# EAGLE design lcmeter (EAGLE 6.4)
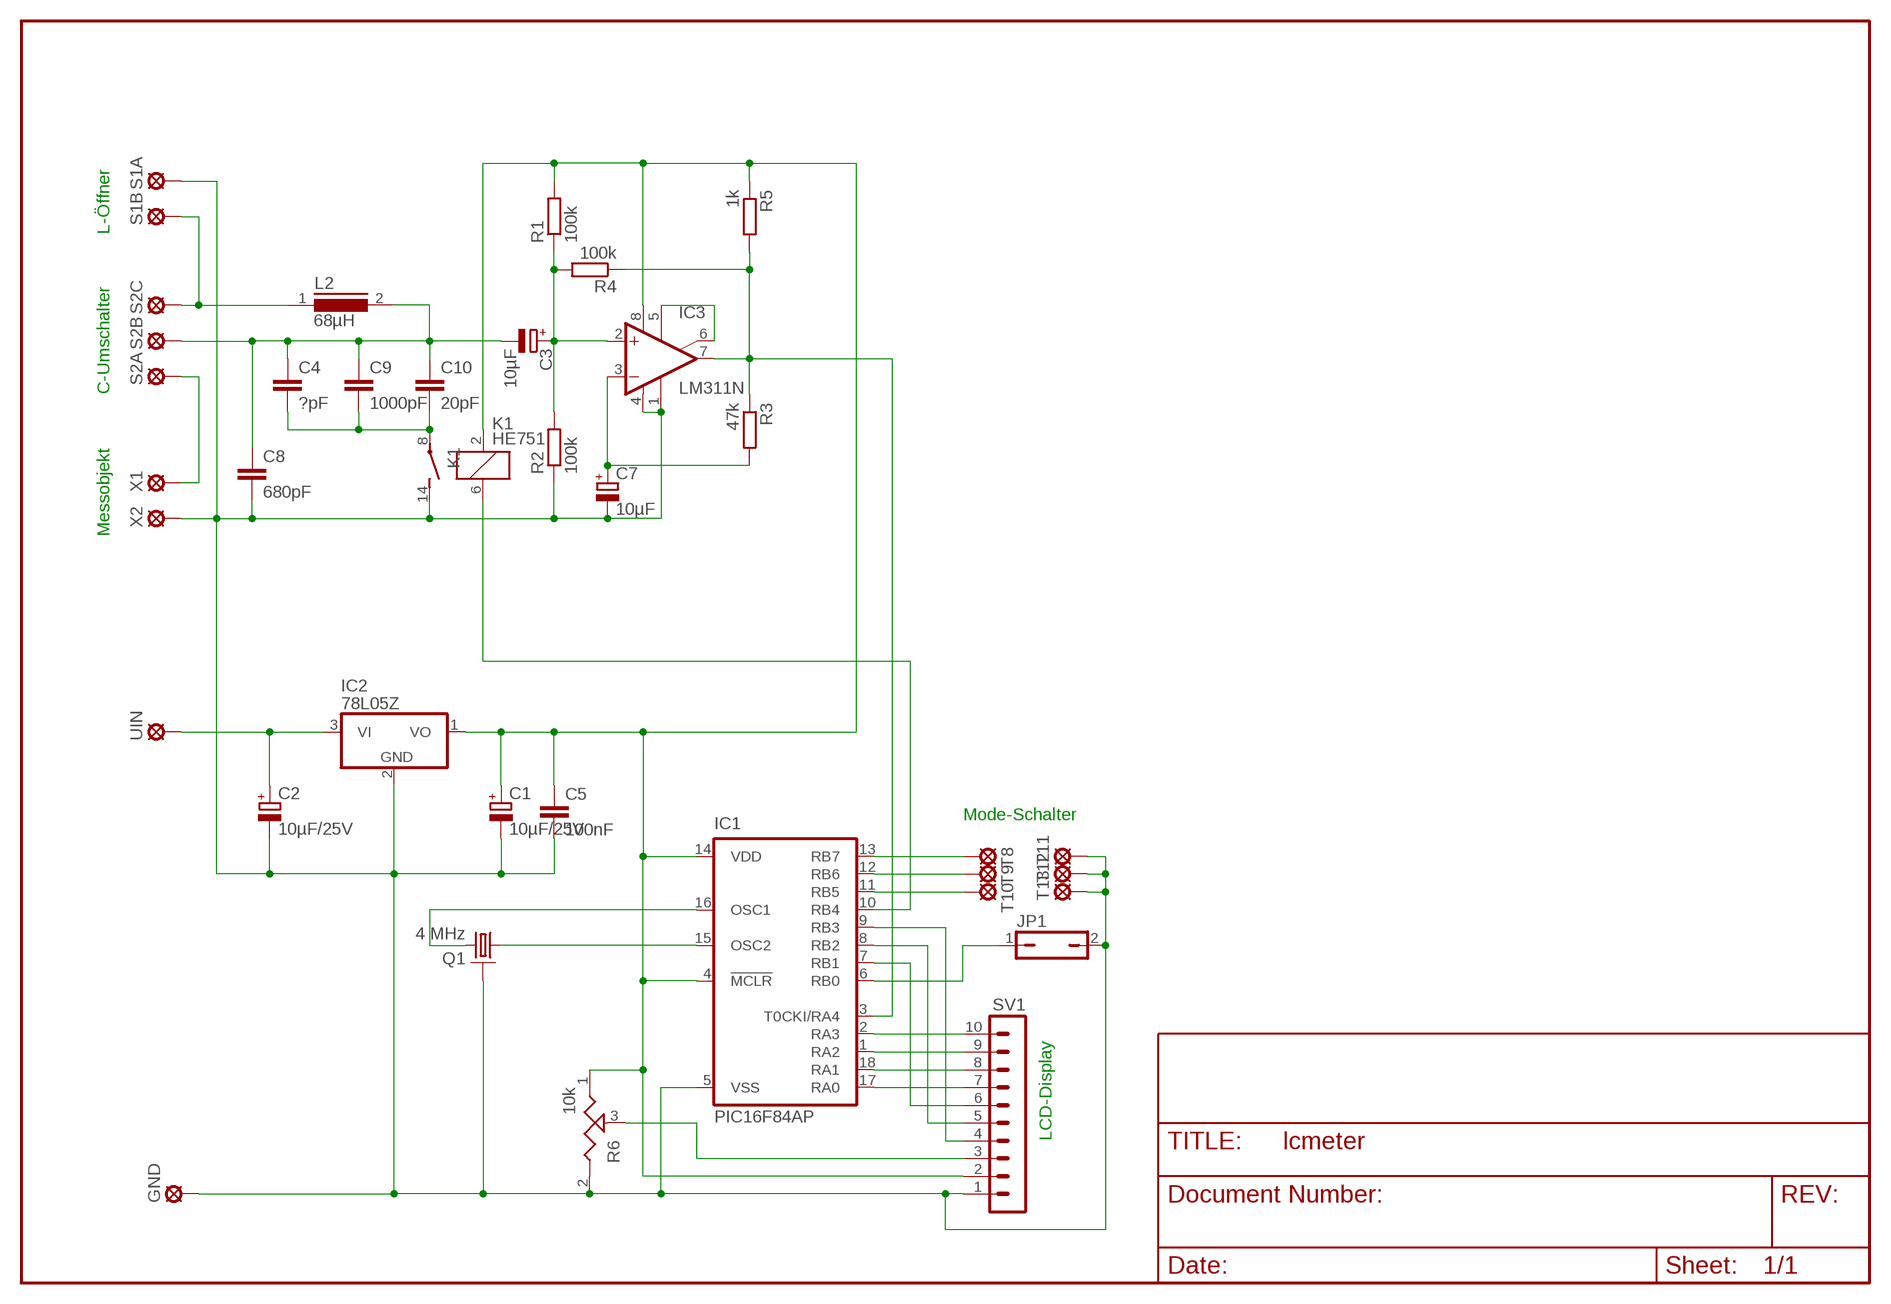
[diagram p0: schematic, sheet 1]

## Parts
C1  10µF/25V  CPOL-EUE2.5-5  [E2,5-5]
C2  10µF/25V  CPOL-EUE2.5-5  [E2,5-5]
C3  10µF  CPOL-EUE5-10.5  [E5-10,5]
C4  ?pF  C-EU150-054X183  [C150-054X183]
C5  100nF  C-EU050-050X075  [C050-050X075]
C7  10µF  CPOL-EUE5-10.5  [E5-10,5]
C8  680pF  C-EU150-054X183  [C150-054X183]
C9  1000pF  C-EU150-054X183  [C150-054X183]
C10  20pF  C-EU150-054X183  [C150-054X183]
GND  LSP10  [LSP10]
IC1  PIC16F84AP  [DIL18]
IC2  78L05Z  [TO92]
IC3  LM311N  [DIL08]
JP1  JP1Q  [JP1]
K1  HE751  [HE751]
L2  68µH  MESC26  [MESC26]
Q1  4 MHz  RESONATOR  [RES3PIN]
R1  100k  R-EU_0309/12  [0309/12]
R2  100k  R-EU_0309/12  [0309/12]
R3  47k  R-EU_0309/12  [0309/12]
R4  100k  R-EU_0309/12  [0309/12]
R5  1k  R-EU_0309/12  [0309/12]
R6  10k  POTUS-L  [PT-10]
S1A  LSP10  [LSP10]
S1B  LSP10  [LSP10]
S2A  LSP10  [LSP10]
S2B  LSP10  [LSP10]
S2C  LSP10  [LSP10]
SV1  MA10-1  [MA10-1]
T8  LSP10  [LSP10]
T9  LSP10  [LSP10]
T10  LSP10  [LSP10]
T11  LSP10  [LSP10]
T12  LSP10  [LSP10]
T13  LSP10  [LSP10]
UIN  LSP10  [LSP10]
X1  LCx1  LSP10  [LSP10]
X2  LSP10  [LSP10]

## Nets
+5V: C1.+ C5.1 IC1.4(!MCLR) IC1.14(VDD) IC2.1(VO) IC3.8(V+) K1.2 R1.2 R5.1 R6.1 SV1.2
GND: C1.- C2.- C5.2 C7.- C8.2 GND.MP IC1.5(VSS) IC2.2(GND) IC3.1(GND) IC3.4(V-) JP1.2 K1.14(2:S) Q1.2 R2.1 R6.2 S1A.MP SV1.1 T11.MP T12.MP T13.MP X2.MP
N$1: IC1.2(RA3) SV1.10
N$2: IC1.1(RA2) SV1.9
N$3: IC1.18(RA1) SV1.8
N$4: IC1.17(RA0) SV1.7
N$5: IC1.7(RB1) SV1.6
N$6: IC1.8(RB2) SV1.5
N$7: IC1.9(RB3) SV1.4
N$8: L2.1 S1B.MP S2C.MP
N$10: C3.+ IC3.2(+IN) R1.1 R2.2 R4.2
N$11: C2.+ IC2.3(VI) UIN.MP
N$12: IC1.15(OSC2) Q1.1
N$13: IC1.16(OSC1) Q1.3
N$14: IC1.6(RB0) JP1.1
N$15: C7.+ IC3.3(-IN) R3.2
N$17: IC3.5(ON) IC3.6(ON/STR)
N$18: IC1.3(T0CKI/RA4) IC3.7(OUT) R3.1 R4.1 R5.2
N$19: C3.- C4.1 C8.1 C9.1 C10.1 L2.2 S2B.MP
N$20: C4.2 C9.2 C10.2 K1.8(2:P)
N$21: IC1.10(RB4) K1.6
N$22: S2A.MP X1.MP
N$23: R6.3 SV1.3
N$25: IC1.13(RB7) T8.MP
N$26: IC1.12(RB6) T9.MP
N$27: IC1.11(RB5) T10.MP

## Notes on the sheet
- L-Öffner
- C-Umschalter
- Messobjekt
- Mode-Schalter
- LCD-Display

## Library data of the parts
C1-C3 C7 = rcl:CPOL-EU: POLARIZED CAPACITOR, European symbol
C4 C5 C8-C10 = rcl:C-EU: CAPACITOR, European symbol
GND S1A S1B S2A S2B S2C T8-T13 UIN X1 X2 = solpad:LSP10: SOLDER PAD drill 1.0 mm, distributor Buerklin, 12H555
IC1 = microchip:PIC16F8*: MICROCONTROLLER 8-Bit PIC16F8X Family - CMOS Flash/EEPROM Pin Compatible : PIC16F83, PIC16CR83, PIC16F84A, PIC16CR84 see also PIC16C*
IC2 = linear:78*: Positive VOLTAGE REGULATOR
IC3 = linear:LM311: COMPARATOR
JP1 = jumper:JP1Q: JUMPER
K1 = relay:HE751: RELAY reed, 1 x norm. open, Hamlin
L2 = inductors:MESC26: INDUCTOR
Q1 = sprut:RESONATOR: CRYSTAL
R1-R5 = rcl:R-EU_: RESISTOR, European symbol
R6 = discrete:POTUS-L
SV1 = con-lstb:MA10-1: PIN HEADER

## Board
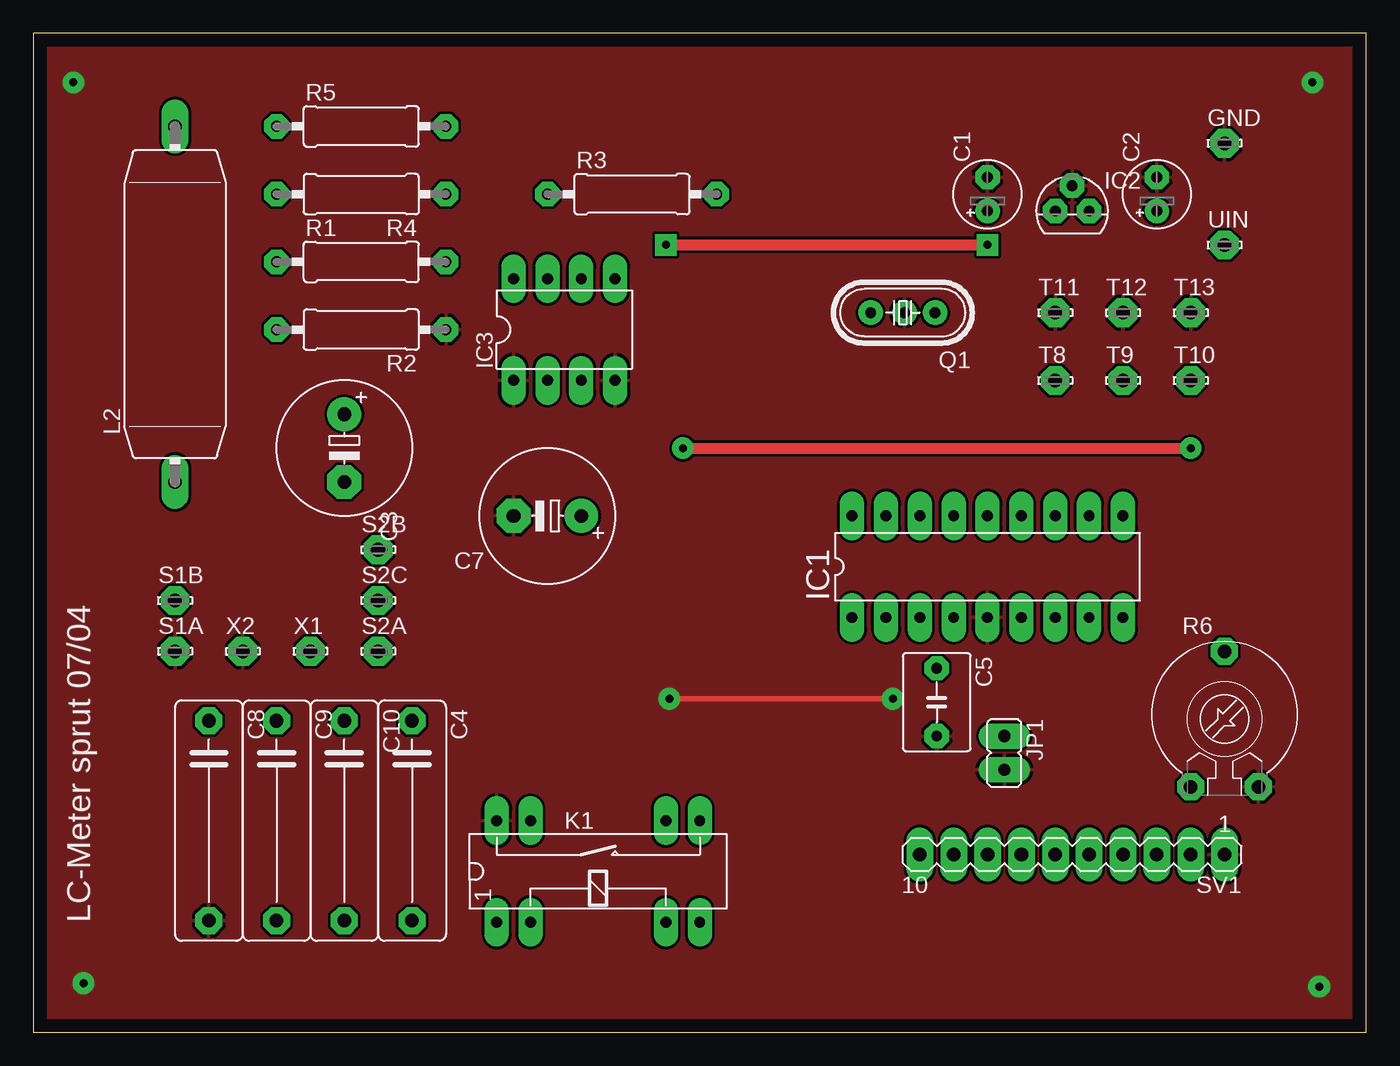
[diagram p1: board, top side]
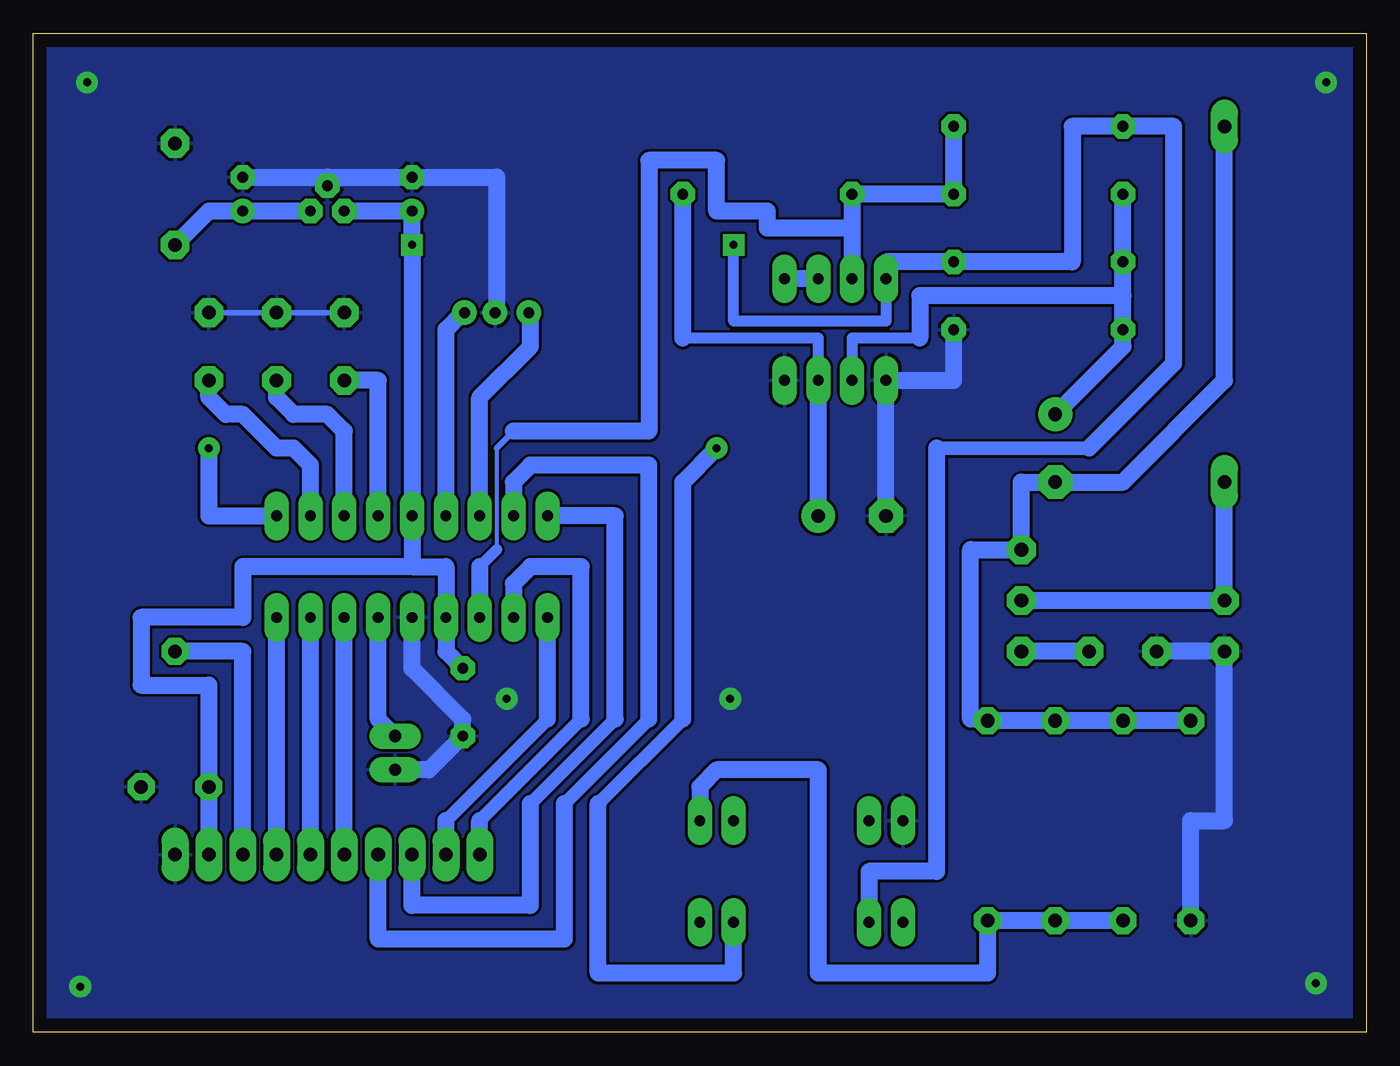
[diagram p2: board, bottom side, seen from below]

Size 100 x 74.92 mm. Coordinates in mm from the lower left corner, seen from the top.
Outline: 0,0 100,0 100,74.92 0,74.92 0,0
Copper layers (1*16): Top 0.035mm / dielectric 1.5mm / Bottom 0.035mm
Design rules "leiterplatte mit löchern": minimum track width 10mil, minimum drill 12mil, track to track 8mil, track to pad 8mil, pad to pad 8mil, via to via 8mil, smd to smd 8mil, copper to edge 40mil, drill to drill 8mil, minimum pad ring 20mil, minimum via ring 20mil, stop-mask expansion 4mil, vias tented up to drill 0mil, thermal gap 10mil

### Footprints (pad centres in the part's own frame; a part is rotated, then mirrored left to right if it is on the bottom)
E2,5-5 = drill 0.813 pad 1.6: + -1.27,0 | drill 0.813 pad 1.6 octagon: - 1.27,0
E5-10,5 = drill 1.016 pad 2.54: + -2.54,0 | drill 1.016 pad 2.54 octagon: - 2.54,0
C150-054X183 = drill 1.016 octagon: 1 -7.493,0; 2 7.493,0
C050-050X075 = drill 0.813 octagon: 1 -2.54,0; 2 2.54,0
LSP10 = drill 1.016 pad 2.159 octagon: MP 0,0
DIL18 = drill 0.813 long: 1 -10.16,-3.81; 2 -7.62,-3.81; 3 -5.08,-3.81; 4 -2.54,-3.81; 5 0,-3.81; 6 2.54,-3.81; 7 5.08,-3.81; 8 7.62,-3.81; 9 10.16,-3.81; 10 10.16,3.81; 11 7.62,3.81; 12 5.08,3.81; 13 2.54,3.81; 14 0,3.81; 15 -2.54,3.81; 16 -5.08,3.81; 17 -7.62,3.81; 18 -10.16,3.81
TO92 = drill 0.813 octagon: 1 -1.27,0; 2 0,1.905; 3 1.27,0
DIL08 = drill 0.813 long: 1 -3.81,-3.81; 2 -1.27,-3.81; 3 1.27,-3.81; 4 3.81,-3.81; 5 3.81,3.81; 6 1.27,3.81; 7 -1.27,3.81; 8 -3.81,3.81
JP1 = drill 0.914 long: 1 0,-1.27; 2 0,1.27
HE751 = drill 0.813 long: 1 -7.62,-3.81; 2 -5.08,-3.81; 6 5.08,-3.81; 7 7.62,-3.81; 8 7.62,3.81; 9 5.08,3.81; 13 -5.08,3.81; 14 -7.62,3.81
MESC26 = drill 1.016 long: 1 -13.335,0; 2 13.335,0
RES3PIN = drill 0.813: 1 -2.413,0; 2 -0.127,0; 3 2.413,0
0309/12 = drill 0.813 octagon: 1 -6.35,0; 2 6.35,0
PT-10 = drill 1.016 pad 1.778 octagon: 1 -2.54,-5.08; 2 2.54,-5.08; 3 0,5.08
MA10-1 = drill 1.016 long: 1 -11.43,0; 2 -8.89,0; 3 -6.35,0; 4 -3.81,0; 5 -1.27,0; 6 1.27,0; 7 3.81,0; 8 6.35,0; 9 8.89,0; 10 11.43,0

### Placement (x,y rotation side)
C1  71.59,62.86 90 top
C2  84.29,62.86 90 top
C3  23.33,43.81 270 top
C4  28.41,15.87 270 top
C5  67.78,24.76 270 top
C7  38.57,38.73 180 top
C8  13.17,15.87 270 top
C9  18.25,15.87 270 top
C10  23.33,15.87 270 top
GND  89.37,66.67 0 top
IC1  71.59,34.92 0 top
IC2  77.94,61.59 0 top
IC3  39.84,52.7 0 top
JP1  72.86,20.95 180 top
K1  42.38,12.06 0 top
L2  10.63,54.61 90 top
Q1  65.24,53.97 180 top
R1  24.6,57.78 0 top
R2  24.6,52.7 180 top
R3  44.92,62.86 0 top
R4  24.6,62.86 180 top
R5  24.6,67.94 0 top
R6  89.37,23.49 0 top
S1A  10.63,28.57 0 top
S1B  10.63,32.38 0 top
S2A  25.87,28.57 0 top
S2B  25.87,36.19 0 top
S2C  25.87,32.38 0 top
SV1  77.94,13.33 180 top
T8  76.67,48.89 0 top
T9  81.75,48.89 0 top
T10  86.83,48.89 0 top
T11  76.67,53.97 0 top
T12  81.75,53.97 0 top
T13  86.83,53.97 0 top
UIN  89.37,59.05 0 top
X1  20.79,28.57 0 top
X2  15.71,28.57 0 top

### Tracks (layer width: path | path; a pad name or v marks a point on that pad's centre or on a via)
+5V  (via drill 0.61)
  Top 0.813: v47.46,59.05 v71.59,59.05
  Bottom 0.813: v47.46,59.05 47.46,53.34 36.03,53.34 IC3.8
  Bottom 1.016: 32.22,43.81 20.79,43.81
  Bottom 1.27: IC3.8 36.03,57.78 R1.2 22.06,57.78 22.06,67.94 R5.1 14.44,67.94 14.44,50.16 20.79,43.81 | 71.59,34.92 69.05,34.92 IC1.4 69.05,28.57 C5.1 | 71.59,34.92 IC1.14 v71.59,59.05 C1.+ IC2.1 | SV1.2 R6.1 86.83,26.03 91.91,26.03 91.91,31.11 84.29,31.11 84.29,34.92 71.59,34.92 | K1.2 37.3,12.06 32.22,12.06 32.22,43.81
GND  (via drill 0.6)
  Top 0.406: v64.48,25.01 v47.71,25.01
  Bottom 0.406: 77.94,64.13 IC2.2 | T11.MP T12.MP T13.MP
  Bottom 1.27: C2.- 77.94,64.13 C1.- 65.24,64.13 65.24,53.97 | C8.2 13.17,15.87 10.63,15.87 S1A.MP X2.MP | IC1.5 71.59,27.3 67.78,23.49 C5.2 70.32,19.68 JP1.2 | R2.1 30.95,48.89 IC3.1 C7.-
  other vias: 3.77,3.68 96.48,3.42 3.01,71.24 95.97,71.24
  pour Bottom: -0.04,-0.13 99.78,-0.13 99.78,75.05 -0.04,75.05
  pour Top: -0.04,-0.13 100.04,-0.13 100.04,75.05 -0.04,75.05
N$1
  Bottom 1.016: 66.51,15.87 58.89,23.49
  Bottom 1.27: IC1.2 63.97,33.65 62.7,34.92 58.89,34.92 58.89,23.49 | SV1.10 66.51,15.87
N$2
  Bottom 1.016: 69.05,15.87 61.43,23.49
  Bottom 1.27: 61.43,23.49 IC1.1 | SV1.9 69.05,15.87
N$3
  Bottom 1.016: 62.7,17.14 56.35,23.49
  Bottom 1.27: IC1.18 56.35,38.73 56.35,23.49 | 62.7,17.14 62.7,9.52 71.59,9.52 SV1.8
N$4
  Bottom 1.016: 60.16,17.14 53.81,23.49
  Bottom 1.27: IC1.17 63.97,41.27 62.7,42.54 53.81,42.54 53.81,23.49 | 60.16,17.14 60.16,6.98 74.13,6.98 SV1.7
N$5
  Bottom 1.27: SV1.6 IC1.7
N$6
  Bottom 1.27: SV1.5 IC1.8
N$7
  Bottom 1.27: SV1.4 IC1.9
N$8
  Bottom 1.27: L2.1 S1B.MP S2C.MP
N$9  (via drill 0.61)
  other vias: 86.83,43.81
N$10
  Bottom 0.813: IC3.2 38.57,52.07 33.49,52.07
  Bottom 1.27: 18.25,55.24 R1.1 R4.2 | C3.+ 18.25,51.43 R2.2 18.25,55.24 | 33.49,52.07 33.49,55.24 18.25,55.24
N$11
  Bottom 1.27: IC2.3 C2.+ 86.83,61.59 UIN.MP
N$12
  Bottom 0.406: 67.78,53.97 Q1.1
  Bottom 1.27: IC1.15 69.05,52.7 67.78,53.97
N$13
  Bottom 0.406: 62.7,53.97 Q1.3
  Bottom 1.27: IC1.16 66.51,47.62 62.7,51.43 62.7,53.97
N$14
  Bottom 1.27: IC1.6 74.13,23.49 JP1.1
N$15
  Bottom 0.813: 51.27,52.07 41.11,52.07 IC3.3
  Bottom 1.27: 51.27,52.07 R3.2 | C7.+ IC3.3
N$17
  Bottom 1.27: IC3.6 IC3.5
N$18
  Bottom 0.305: 65.24,43.81 65.24,36.19
  Bottom 0.406: 63.97,45.08 65.24,43.81
  Bottom 0.813: 65.24,36.19 66.51,34.92
  Bottom 1.27: R3.1 38.57,60.32 44.92,60.32 44.92,61.59 48.73,61.59 48.73,65.4 53.81,65.4 53.81,45.08 63.97,45.08 | 66.51,34.92 IC1.3 | R3.1 IC3.7 | R3.1 R4.1 R5.2
N$19
  Bottom 0.406: C4.1 28.41,23.49 | C10.1 23.33,23.49 23.46,23.36 | 18.25,23.49 C9.1 | 18.25,23.49 18.38,23.36 | 18.12,23.36 18.25,23.49
  Bottom 1.27: L2.2 10.63,48.89 18.25,41.27 C3.- 25.87,41.27 S2B.MP 29.68,36.19 29.68,23.49 28.41,23.49 | 23.46,23.36 C4.1 | 18.38,23.36 C10.1 | C8.1 18.12,23.36
N$20
  Bottom 0.406: C10.2 23.33,8.25 23.2,8.38 | C4.2 28.41,8.25 28.28,8.38
  Bottom 1.27: C9.2 23.2,8.38 | C10.2 28.28,8.38 | C4.2 28.41,4.44 41.11,4.44 41.11,19.68 48.73,19.68 50,18.41 K1.8
N$21  (via drill 0.61)
  Top 0.813: v48.73,43.81 v86.83,43.81
  Bottom 1.016: 57.62,17.14 51.27,23.49
  Bottom 1.27: IC1.10 86.83,38.73 v86.83,43.81 | 51.27,23.49 51.27,41.27 v48.73,43.81 | 57.62,17.14 57.62,4.44 47.46,4.44 K1.6
N$22
  Bottom 1.27: X1.MP S2A.MP
N$23
  Bottom 1.27: SV1.3 84.29,28.57 R6.3
N$25
  Bottom 1.27: IC1.13 74.13,48.89 T8.MP
N$26
  Bottom 1.27: IC1.12 76.67,45.08 77.94,46.35 80.48,46.35 81.75,47.62 T9.MP
N$27
  Bottom 1.27: IC1.11 79.21,42.54 80.48,43.81 81.75,43.81 84.29,46.35 85.56,46.35 86.83,47.62 T10.MP

### Text on the board
tPlace: LC-Meter sprut 07/04